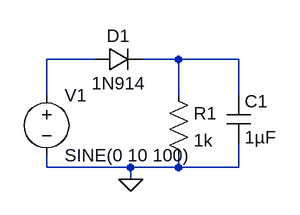
[diagram p0: schematic 4Halfwaverec(C).asc]
4Halfwaverec(C).asc, the LTspice schematic file:
Version 4
SHEET 1 880 680
WIRE -112 64 -176 64
WIRE 0 64 -48 64
WIRE 80 64 0 64
WIRE -176 112 -176 64
WIRE 0 112 0 64
WIRE 80 112 80 64
WIRE -176 208 -176 192
WIRE -64 208 -176 208
WIRE 0 208 0 192
WIRE 0 208 -64 208
WIRE 80 208 80 176
WIRE 80 208 0 208
WIRE -64 224 -64 208
FLAG -64 224 0
SYMBOL voltage -176 96 R0
WINDOW 123 0 0 Left 0
WINDOW 39 0 0 Left 0
SYMATTR InstName V1
SYMATTR Value SINE(0 10 100)
SYMBOL diode -112 80 R270
WINDOW 0 32 32 VTop 2
WINDOW 3 0 32 VBottom 2
SYMATTR InstName D1
SYMATTR Value 1N914
SYMBOL res -16 96 R0
SYMATTR InstName R1
SYMATTR Value 1k
SYMBOL cap 64 112 R0
SYMATTR InstName C1
SYMATTR Value 1µF

The netlist it stands for:
* 4Halfwaverec(C).asc
V1 N001 0 SINE(0 10 100)
D1 N001 N002 1N914
R1 N002 0 1k
C1 N002 0 1µF
.model D D
.lib standard.dio
.backanno
.end